# Altium schematic sheet Gas_Sampler-GPS.SchDoc: GPS
size Tabloid; Organization: Sensible Robotics LLC; Address1: 120 E Church Ave Suite B; Address2: Ridgecrest CA, 93555; Revision: 0; SheetNumber: 8; SheetTotal: 12; ApprovedBy: Approved Name; Engineer: Mike Licitra; PageSetup: Record=PageOptions|CenterHorizontal=True|CenterVertical=True|PrintScale=0.98|XCorrection=1.00|YCorrection=1.00|PrintKind=0|BorderSize=5000000|LeftOffset=0|BottomOffset=0|Orientation=2|PaperLength=1000|PaperWidth=1000|Scale=100|PaperSource=15|PrintQuality=600|MediaType=1|DitherType=10|PaperKind=Tabloid|PrintScaleMode=1
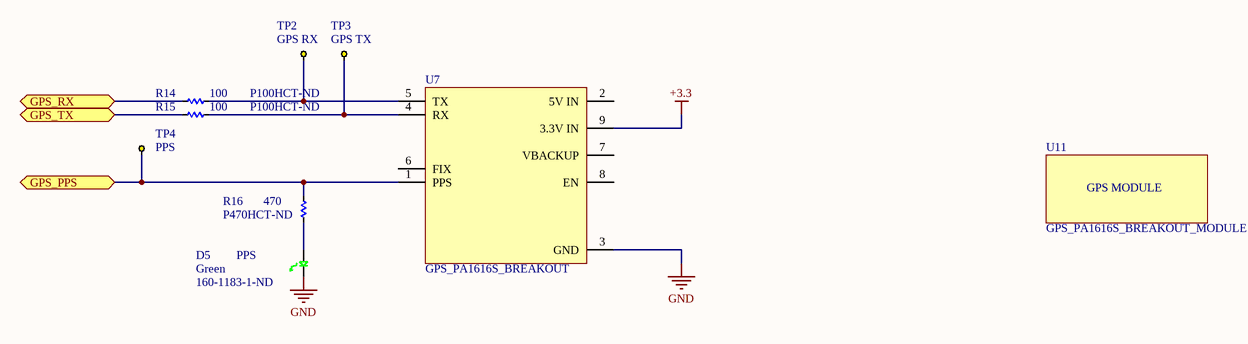
[diagram p0: Gas_Sampler-GPS.SchDoc]

## Parts
D5  PPS  Color: Green  Supplier Part Number 1: 160-1183-1-ND  [LED_0603_GREEN]
R14  value 100  Supplier Part Number 1: P100HCT-ND  [R0603]  (hidden comment: RES_0603_100_OHM_1/10W_1%)
R15  value 100  Supplier Part Number 1: P100HCT-ND  [R0603]  (hidden comment: RES_0603_100_OHM_1/10W_1%)
R16  value 470  Supplier Part Number 1: P470HCT-ND  [R0603]  (hidden comment: RES_0603_470_OHM_1/10W_1%)
TP2  GPS RX  [TP_KEYSTONE_5001]
TP3  GPS TX  [TP_KEYSTONE_5001]
TP4  PPS  [TP_KEYSTONE_5001]
U7  GPS_PA1616S_BREAKOUT  [HEADER_1X9_POS_UNSHROUDED]
U11  GPS_PA1616S_BREAKOUT_MODULE  [GPS_PA1616S_BREAKOUT]

## Ports
GPS_PPS, GPS_RX, GPS_TX

## Nets
+3.3: U7.9(3.3V_IN)
GND: D5.2(CATHODE) U7.3(GND)
GPS_PPS: R16.2 TP4.1 U7.1(PPS) ; port GPS_PPS
GPS_RX: R14.1 ; port GPS_RX
GPS_TX: R15.1 ; port GPS_TX
NetD5_1: D5.1(ANODE) R16.1
NetR14_2: R14.2 TP2.1 U7.5(TX)
NetR15_2: R15.2 TP3.1 U7.4(RX)

Not connected (* = marked no-connect by the designer): U7 2(5V_IN) 6(FIX) 7(VBACKUP) 8(EN)

## Notes on the sheet
- CONFIDENTIAL DOCUMENT
- DUPLICATION PROHIBITED
- ENGINEER
- PCB FAB #
- SCH #
- REV
- Sensible
- Robotics
- THIS DOCUMENT CONTAINS INFORMATION AND OR DATA, WHICH IS PROPRIETARY AND CONFIDENTIAL TO SENSIBLE ROBOTICS LLC.  THIS INFORMATION AND OR DATA, IS TO BE USED ONLY FOR THE BENEFIT OF THE SUPPLIER, AND IS NOT TO BE USED FOR THE BENEFIT OF OTHER PARTIES WITHOUT WRITTEN CONSENT.
- DATE
- PCB ASSY #
- SIZE
- Tabloid
- SHEET
- OF
- FILE
- (in symbol GPS_PA1616S_BREAKOUT_MODULE) GPS MODULE

## Library data of the parts
D5 = LED_0603_GREEN_LG_LTST-C190GKT: LED GREEN CLEAR 0603 SMD; Manufacturer: Lite-On Inc; Millicandela Rating: 6mcd; Wavelength - Dominant: 569nm; Wavelength - Peak: 565nm; Viewing Angle: 130°; Lens Style/Size: Rectangle with Flat Top, 1.1mm x 0.8mm; Voltage - Forward (Vf) Typ: 2.1V; Current - Test: 10mA; Supplier 1: Digi-Key; Manufacturer Part Number: LTST-C190GKT; Lens Type: Clear; Package / Case: 0603 (1608 Metric); Size / Dimension: 1.60mm L x 0.80mm W; Height: 0.80mm; Mounting Type: Surface Mount; Packaging: Cut Tape (CT); ComponentLink1URL: http://media.digikey.com/pdf/Data%20Sheets/Lite-On%20PDFs/LTST-C190GKT.pdf; ComponentLink1Description: Datasheet
R14 R15 = RES_0603_100_OHM_1/10W_1%: RES 100 OHM 1/10W 1% 0603 SMD; Manufacturer: Panasonic Electronic Components; Manufacturer Part Number: ERJ-3EKF1000V; Part Number: 470-00121-00; Power (Watts): 0.1W, 1/10W; Temperature Coefficient: ±100ppm/°C; Supplier 1: Digi-Key; RoHS: RoHS Compliant; Category: Resistors; Stock 1: 1025169; Pricing 1: 1=0.1, 50=0.0138, 100=0.0105, 250=0.0078, 500=0.00576, 1000=0.00384 (USD); Packaging: Cut Tape (CT); Composition: Thick Film; Features: -; Tolerance: ±1%; Package / Case: 0603 (1608 Metric); Supplier Device Package: 0603; Size / Dimension: 0.063" L x 0.031" W (1.60mm x 0.80mm); Height: 0.022" (0.55mm); Number of Terminations: 2; ComponentLink1URL: http://industrial.panasonic.com/www-cgi/jvcr13pz.cgi?E+PZ+3+AOA0002+ERJ3EKF1000V+7+WW; ComponentLink1Description: http://industrial.panasonic.com/www-cgi/jvcr13pz.cgi?E+PZ+3+AOA0002+ERJ3EKF1000V+7+WW
R16 = RES_0603_470_OHM_1/10W_1%: RES 470 OHM 1/10W 1% 0603 SMD; Manufacturer: Panasonic Electronic Components; Manufacturer Part Number: ERJ-3EKF4700V; Part Number: 470-00157-00; Power (Watts): 0.1W, 1/10W; Temperature Coefficient: ±100ppm/°C; Supplier 1: Digi-Key; RoHS: RoHS Compliant; Category: Resistors; Stock 1: 212428; Pricing 1: 1=0.1, 50=0.0138, 100=0.0105, 250=0.0078, 500=0.00576, 1000=0.00384 (USD); Packaging: Cut Tape (CT); Composition: Thick Film; Features: -; Tolerance: ±1%; Package / Case: 0603 (1608 Metric); Supplier Device Package: 0603; Size / Dimension: 0.063" L x 0.031" W (1.60mm x 0.80mm); Height: 0.022" (0.55mm); Number of Terminations: 2; ComponentLink1URL: http://industrial.panasonic.com/www-cgi/jvcr13pz.cgi?E+PZ+3+AOA0002+ERJ3EKF4700V+7+WW; ComponentLink1Description: http://industrial.panasonic.com/www-cgi/jvcr13pz.cgi?E+PZ+3+AOA0002+ERJ3EKF4700V+7+WW
TP2-TP4 = TEST_KEYSTONE5001: PC TEST POINT TH RING; Manufacturer: Keystone Electronics; Manufacturer Part Number: 5001; Part Number: 250-00184-00; Supplier 1: Digi-Key; Supplier Part Number 1: 5001K-ND; RoHS: RoHS Compliant; Category: Test and Measurement; Stock 1: 341830; Pricing 1: 1=0.33, 10=0.309, 50=0.2252, 100=0.2164, 250=0.19432, 500=0.18548, 1000=0.15456, 2500=0.14131, 5000=0.13248 (USD); Packaging: Bulk; Type: PC Test Point, Miniature; Terminal: 0.010" x 0.020" (0.25mm x 0.51mm) Phosphor Bronze Wire, Silver Plate; Mounting Type: 0.040" (1.02mm) Hole Diameter; Material: Base, Nylon 46, UL 94V-0; Color: Black; ComponentLink1URL: http://www.keyelco.com/product-pdf.cfm?p=1310; ComponentLink1Description: http://www.keyelco.com/product-pdf.cfm?p=1310
U7 = GPS_PA1616S_BREAKOUT: Adafruit Ultimate GPS Breakout - 66 channel w/10 Hz updates - PA1616S
U11 = GPS_PA1616S_BREAKOUT_MODULE: Adafruit Ultimate GPS Breakout - 66 channel w/10 Hz updates - PA1616S